# Altium schematic sheet lcd33.SchDoc
size A4
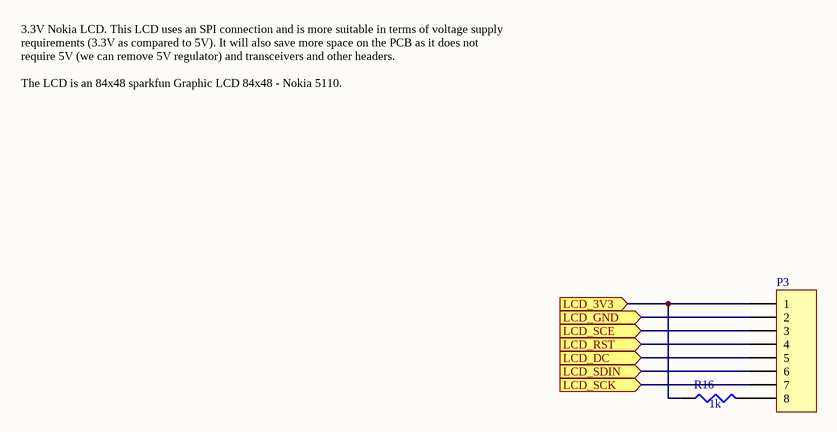
[diagram p0: lcd33.SchDoc]

## Parts
P3  Header 8H  [HDR1X8H]  (value not drawn)
R16  value 1k  [0603]  (hidden comment: RES1)

## Ports
LCD_3V3 (in), LCD_DC (in), LCD_GND (in), LCD_RST (in), LCD_SCE (in), LCD_SCK (in), LCD_SDIN (in)

## Nets
LCD_3V3: P3.1 R16.1 ; port LCD_3V3
LCD_DC: P3.5 ; port LCD_DC
LCD_GND: P3.2 ; port LCD_GND
LCD_RST: P3.4 ; port LCD_RST
LCD_SCE: P3.3 ; port LCD_SCE
LCD_SCK: P3.7 ; port LCD_SCK
LCD_SDIN: P3.6 ; port LCD_SDIN
NetP3_8: P3.8 R16.2

## Notes on the sheet
- 3.3V Nokia LCD. This LCD uses an SPI connection and is more suitable in terms of voltage supply
  requirements (3.3V as compared to 5V). It will also save more space on the PCB as it does not
  require 5V (we can remove 5V regulator) and transceivers and other headers.
  The LCD is an 84x48 sparkfun Graphic LCD 84x48 - Nokia 5110.

## Library data of the parts
P3 = Header 8H: Header, 8-Pin, Right Angle
R16 = RES1: Resistor